# Altium schematic sheet motorboard_simp_power.SchDoc
size A
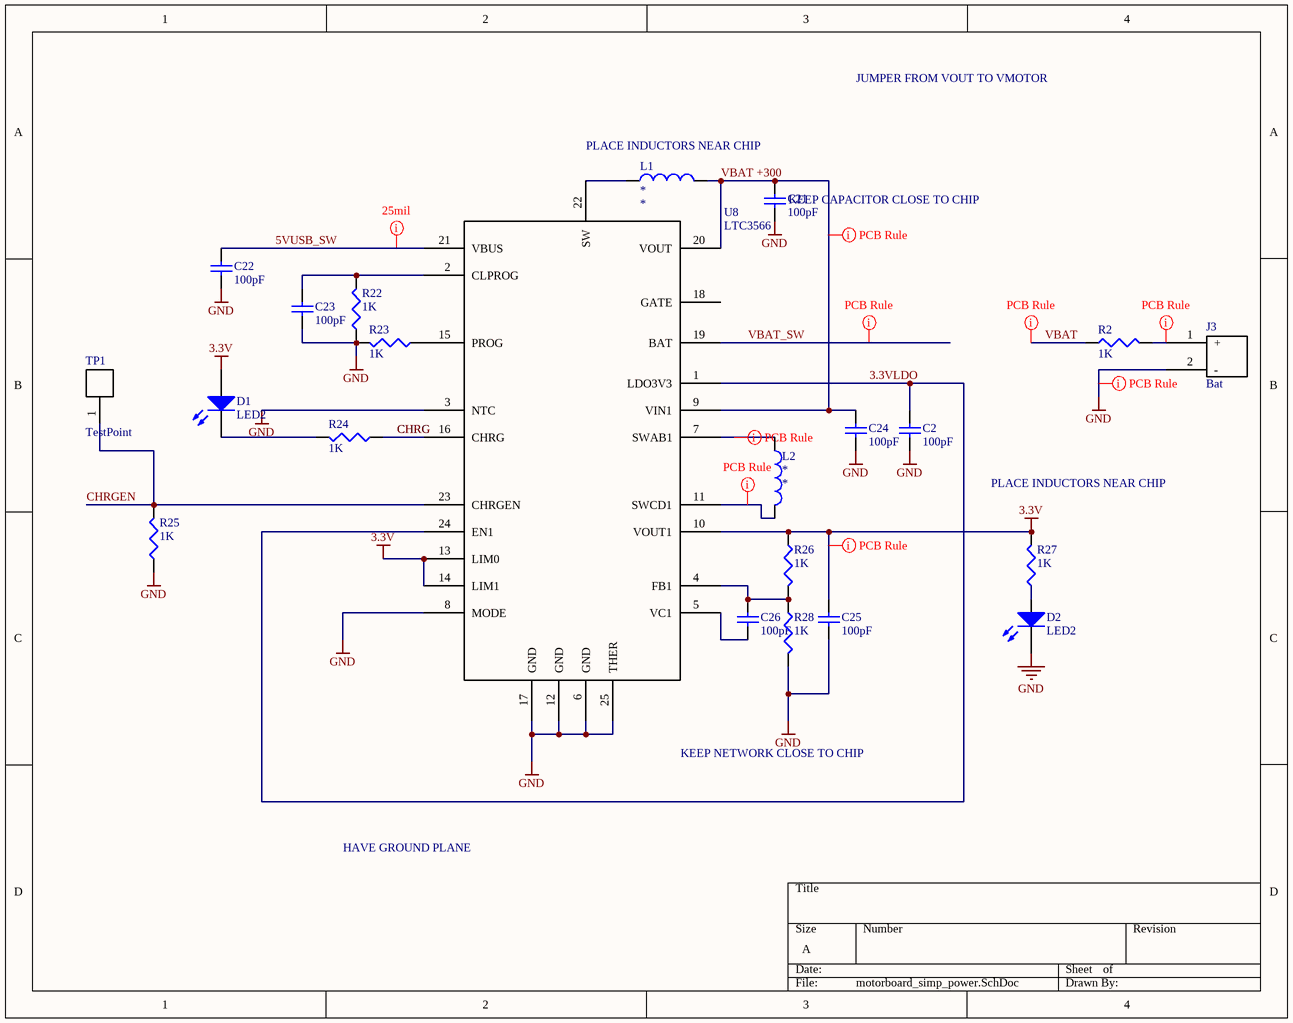
[diagram p0: motorboard_simp_power.SchDoc]

## Parts
C2  value 100pF  [RAD-0.3]  (hidden comment: Cap)
C21  value 100pF  [RAD-0.3]  (hidden comment: Cap)
C22  value 100pF  [RAD-0.3]  (hidden comment: Cap)
C23  value 100pF  [RAD-0.3]  (hidden comment: Cap)
C24  value 100pF  [RAD-0.3]  (hidden comment: Cap)
C25  value 100pF  [RAD-0.3]  (hidden comment: Cap)
C26  value 100pF  [RAD-0.3]  (hidden comment: Cap)
D1  LED2  [DSO-F2/D6.1]
D2  LED2  [DSO-F2/D6.1]
J3  Bat  [BatteryConnJST]
L1  *  [Inductor-Power]
L2  *  [Inductor-Power]
R2  value 1K  [RESC1608L]  (hidden comment: Res3)
R22  value 1K  [RESC1608L]  (hidden comment: Res3)
R23  value 1K  [RESC1608L]  (hidden comment: Res3)
R24  value 1K  [RESC1608L]  (hidden comment: Res3)
R25  value 1K  [RESC1608L]  (hidden comment: Res3)
R26  value 1K  [RESC1608L]  (hidden comment: Res3)
R27  value 1K  [RESC1608L]  (hidden comment: Res3)
R28  value 1K  [RESC1608L]  (hidden comment: Res3)
TP1  TestPoint  [TestPoint]
U8  LTC3566  [QFN-24]

## Nets
3.3V: C25.2 D1.1(A) R26.1 R27.2 U8.10(VOUT1) U8.13(LIM0) U8.14(LIM1)
GND: C2.2 C21.1 C22.1 C23.1 C24.2 C25.1 D2.2(K) J3.2(-) R22.1 R23.2 R25.1 R28.2 U8.3(NTC) U8.6(GND) U8.8(MODE) U8.12(GND) U8.17(GND) U8.25(THER)
3.3VLDO: C2.1 U8.1(LDO3V3) U8.24(EN1)
5VUSB_SW: C22.2 U8.21(VBUS)
CHRG: R24.1 U8.16(CHRG)
CHRGEN: R25.2 TP1.1 U8.23(CHRGEN)
VBAT: R2.1
VBAT +300: C21.2 C24.1 L1.2 U8.9(VIN1) U8.20(VOUT)
VBAT_SW: U8.19(BAT)
NetC23_2: C23.2 R22.2 U8.2(CLPROG)
NetC26_1: C26.1 R26.2 R28.1 U8.4(FB1)
NetC26_2: C26.2 U8.5(VC1)
NetD1_2: D1.2(K) R24.2
NetD2_1: D2.1(A) R27.1
NetJ3_1: J3.1(+) R2.2
NetL1_1: L1.1 U8.22(SW)
NetL2_1: L2.1 U8.7(SWAB1)
NetL2_2: L2.2 U8.11(SWCD1)
NetR23_1: R23.1 U8.15(PROG)

Not connected (* = marked no-connect by the designer): U8 18(GATE)

## Layout directives
rule Width Constraint [Pref Width = 25mil    Min Width = 10mil    Max Width = 25mil]: 5VUSB_SW, GND, NetJ3_1, NetL2_1, NetL2_2, VBAT, VBAT +300
rule Width Constraint [Pref Width = 25mil    Min Width = 10mil    Max Width = 100mil]: 3.3V
rule Width Constraint [Pref Width = 25mil    Min Width = 10mil    Max Width = 50mil]: VBAT_SW

## Notes on the sheet
- JUMPER FROM VOUT TO VMOTOR
- (near L1) PLACE INDUCTORS NEAR CHIP
- (near C21) KEEP CAPACITOR CLOSE TO CHIP
- CHRG
- PLACE INDUCTORS NEAR CHIP
- KEEP NETWORK CLOSE TO CHIP
- HAVE GROUND PLANE

## Library data of the parts
C2 C21-C26 = Cap: Capacitor; Published: 8-Jun-2000; LatestRevisionDate: 17-Jul-2002; LatestRevisionNote: Re-released for DXP Platform.; PackageReference: RAD-0.3; Publisher: Altium Limited
D1 D2 = LED2: Typical RED, GREEN, YELLOW, AMBER GaAs LED; Published: 8-Jun-2000; LatestRevisionDate: 17-Jul-2002; LatestRevisionNote: Re-released for DXP Platform.; PackageVersion: Feb-2002; PackageReference: 3.2X1.6X1.1; Publisher: Altium Limited
J3 = BatteryConnJST
L1 L2 = Inductor: Value: *
R2 R22-R28 = Res3: Resistor; Published: 8-Jun-2000; LatestRevisionDate: 29-May-2009; LatestRevisionNote: IPC-7351 Footprint Added.; PackageReference: J1-0603; Publisher: Altium Limited; PackageDescription: Chip Resistor